# EasyEDA Pro project ProPrj_New Project_2026-03-26_23-50-09_2026-04-04.epro

# Schematic Schematic1
Board Name: Board1; Create Date: 2026-03-26; Page Name: P1; Project Name: New Project_2026-03-26_23-50-09; Schematic Name: Schematic1; Update Date: 2026-03-27; Company: 嘉立创EDA; Page Size: A4; Version: V1.0
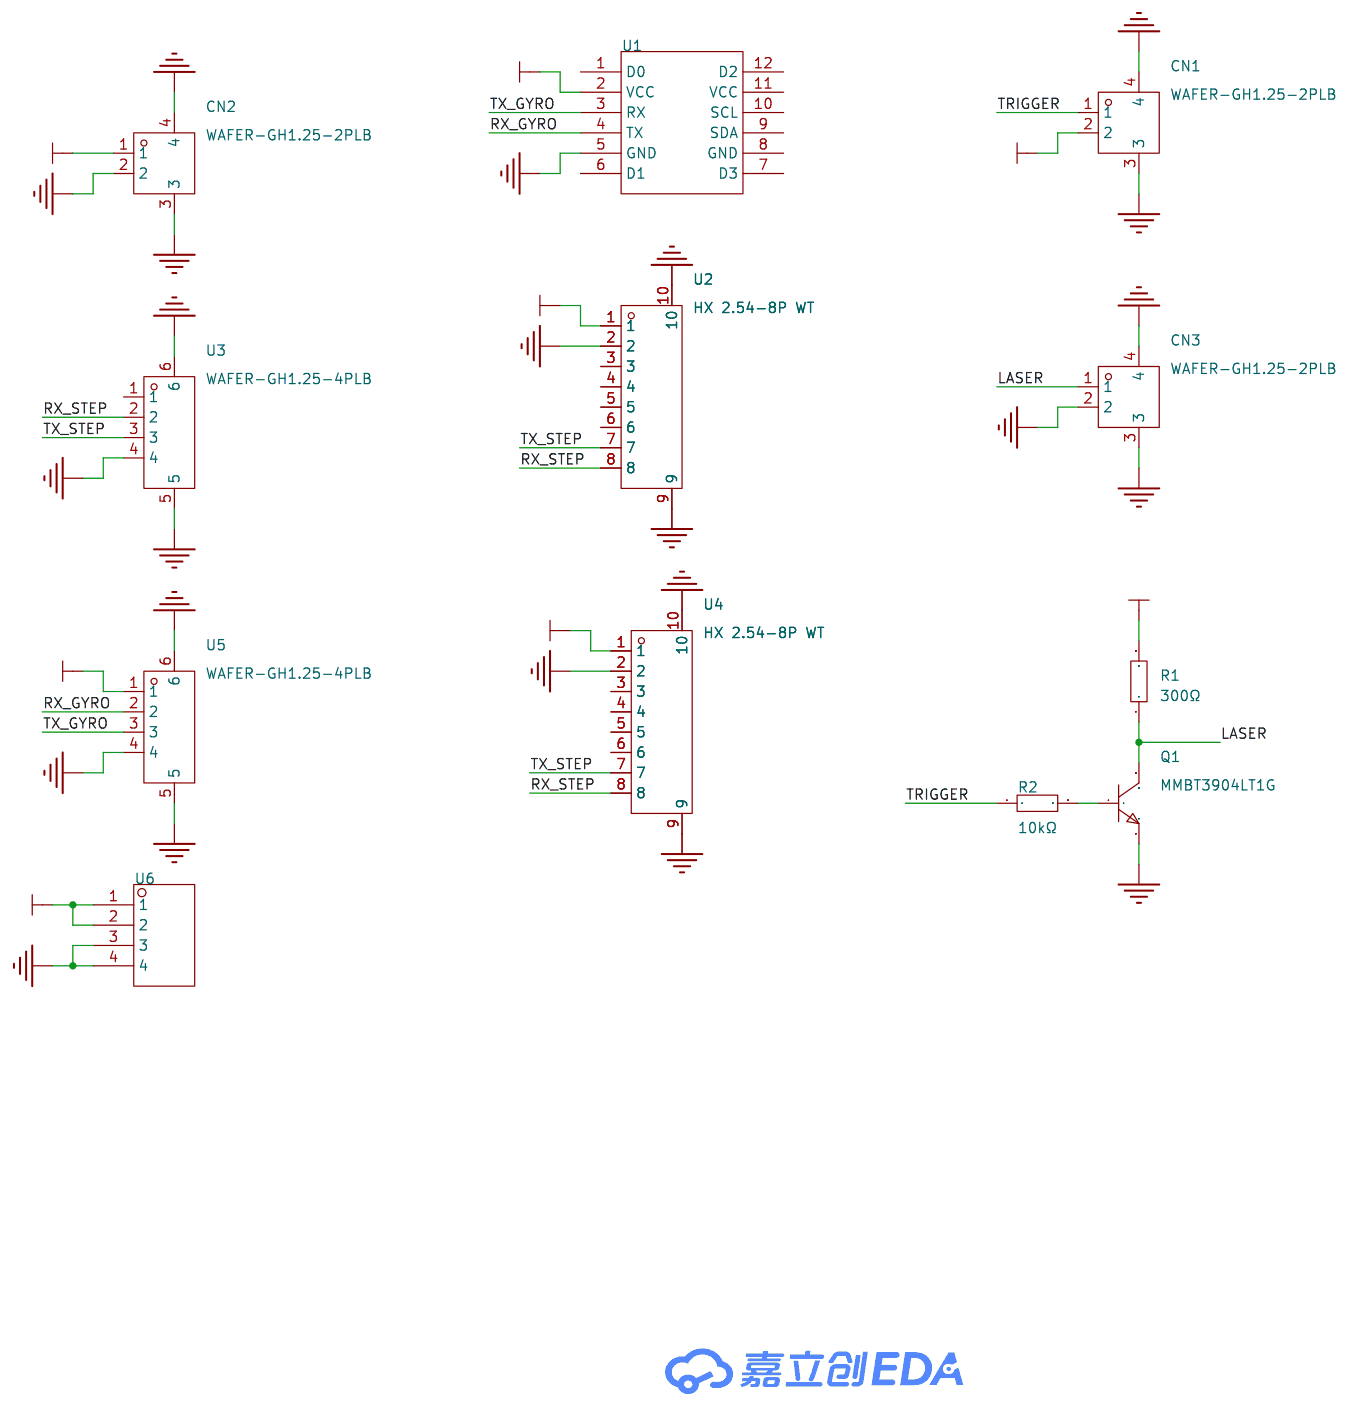
[diagram p0: schematic sheet]

## Parts
CN1  WAFER-GH1.25-2PLB  [CONN-TH_2P-P1.25_XUNPU_WAFER-GH1.25-2PLB]
CN2  WAFER-GH1.25-2PLB  [CONN-TH_2P-P1.25_XUNPU_WAFER-GH1.25-2PLB]
CN3  WAFER-GH1.25-2PLB  [CONN-TH_2P-P1.25_XUNPU_WAFER-GH1.25-2PLB]
Q1  MMBT3904LT1G  [SOT-23-3_L2.9-W1.6-P1.90-LS2.8-BR]
R1  300Ω  [R0603]
R2  10kΩ  [R0603]
U1  -  [JY61P]
U2  HX 2.54-8P WT  [CONN-SMD_8P-P2.50_HANXIA_HX-2.54-8P-WTDK]
U3  WAFER-GH1.25-4PLB  [CONN-SMD_4P-P1.25_XUNPU_WAFER-GH1.25-4PLB]
U4  HX 2.54-8P WT  [CONN-SMD_8P-P2.50_HANXIA_HX-2.54-8P-WTDK]
U5  WAFER-GH1.25-4PLB  [CONN-SMD_4P-P1.25_XUNPU_WAFER-GH1.25-4PLB]
U6  -  [Slip Ring]

## Library data of the parts
CN1-CN3 = WAFER-GH1.25-2PLB: 插针结构:1x2P;间距:1.25mm;安装方式:立贴;参考系列:GH;总PIN数:2P;排数:1;每排PIN数:2;行距:-;额定电流:1A;触头材质:黄铜;触头镀层:锡;工作温度:-25℃~+85℃;; LCSC Part Name: 1x2P 间距:1.25mm 立贴 系列:GH; Supplier Part: C3029368; Manufacturer: XUNPU(讯普); Supplier Footprint: SMD,P=1.25mm; JLCPCB Part Class: 扩展库; Datasheet: https://item.szlcsc.com/datasheet/WAFER-GH1.25-2PLB/3561380.html; Supplier: LCSC; Pins Structure: 1x2P; Pitch: 1.25mm; Mounting Type: 立贴; Reference Series: GH; Number of Pins: 2P; Number of Rows: 1; Number of PINs Per Row: 2; Current Rating: 1A; Contact Material: 黄铜; Contact Plating: 锡; Operating Temperature: -25℃~+85℃; Voltage Rating: 125V; Plastic Material: LCP; Supplementary Features: 辅助焊脚; Color: 米色; Z-Height of the Board: 4.2mm; X-Length of Bottom Edge on Board (Spacing Line): 5.75mm; Y-Width of Bottom Edge on Board: 4.95mm
Q1 = MMBT3904LT1G: 晶体管类型:NPN;集电极电流(Ic):200mA;集射极击穿电压(Vceo):40V;耗散功率(Pd):225mW;直流电流增益(hFE):40@0.1mA,1.0V;; LCSC Part Name: NPN 电流:200mA 电压:40V; Supplier Part: C81464; Manufacturer: onsemi(安森美); Supplier Footprint: SOT-23; JLCPCB Part Class: 扩展库; Datasheet: https://item.szlcsc.com/datasheet/MMBT3904LT1G/82615.html; Supplier: LCSC; type: NPN; Current - Collector(Ic): 200mA; Collector - Emitter Voltage VCEO: 40V; Pd - Power Dissipation: 225mW; DC Current Gain: 40@0.1mA,1.0V; Transition frequency(fT): 300MHz; Current - Collector Cutoff: 50nA; Vce Saturation(VCE(sat)): 200mV; Operating Temperature: -55℃~+150℃
R1 = 0603WAF3000T5E: 电阻类型:厚膜电阻;阻值:300Ω;精度:±1%;功率:100mW;工作电压:75V;温度系数:±100ppm/℃;; LCSC Part Name: 300Ω ±1% 100mW 厚膜电阻; Supplier Part: C23025; Manufacturer: UNI-ROYAL(厚声); Supplier Footprint: 0603; JLCPCB Part Class: 基础库; Datasheet: https://item.szlcsc.com/datasheet/0603WAF3000T5E/23752.html; Supplier: LCSC; Type: 厚膜电阻; Tolerance: ±1%; Power(Watts): 100mW; Voltage-Supply(Max): 75V; Temperature Coefficient: ±100ppm/℃; Operating Temperature: -55℃~+155℃
R2 = RC0603FR-0710KL: 电阻类型:厚膜电阻;阻值:10kΩ;精度:±1%;功率:100mW;最大工作电压:75V;温度系数:±100ppm/℃;; LCSC Part Name: 厚膜电阻 10kΩ ±1% 100mW; Supplier Part: C98220; Manufacturer: YAGEO(国巨); Supplier Footprint: 0603; JLCPCB Part Class: 扩展库; Datasheet: https://atta.szlcsc.com/upload/public/pdf/source/20180927/C295883_E8D83085EA81BD7DE0B2B681138C15EE.pdf; Supplier: LCSC; Type: 厚膜电阻; Tolerance: ±1%; Power(Watts): 100mW; Overload Voltage (Max): 75V; Temperature Coefficient: ±100ppm/℃; Operating Temperature Range: -55℃~+155℃
U1 = JY61P
U2 U4 = HX 2.54-8P WT: 插针结构:1x8P;间距:2.54mm;安装方式:卧贴;参考系列:XH;总PIN数:8P;排数:1;每排PIN数:8;额定电流:3A;工作温度范围:-25℃~+85℃;; LCSC Part Name: 1x8P 间距:2.54mm 卧贴; Supplier Part: C5343093; Manufacturer: hanxia(韩下); Supplier Footprint: SMD,P=2.54mm,卧贴; JLCPCB Part Class: 扩展库; Datasheet: https://atta.szlcsc.com/upload/public/pdf/source/20230104/FDDBA8FE336155D98DF4DE4FDBBBCFC0.pdf; Supplier: LCSC; Pins Structure: 1x8P; Pitch: 2.54mm; Mounting Style: 卧贴; Reference Series: XH; Number of Pins: 8P; Number of Rows: 1; Number of PINs Per Row: 8; Current Rating (Max): 3A; Operating Temperature Range: -25℃~+85℃
U3 U5 = WAFER-GH1.25-4PLB: 插针结构:1x4P;间距:1.25mm;安装方式:立贴;参考系列:GH;总PIN数:4P;排数:1;每排PIN数:4;行距:-;额定电流:1A;触头材质:黄铜;触头镀层:锡;工作温度:-25℃~+85℃;; LCSC Part Name: 1x4P 间距:1.25mm 立贴 系列:GH; Supplier Part: C3029370; Manufacturer: XUNPU(讯普); Supplier Footprint: SMD,P=1.25mm; JLCPCB Part Class: 扩展库; Datasheet: https://item.szlcsc.com/datasheet/WAFER-GH1.25-4PLB/3561382.html; Supplier: LCSC; Pins Structure: 1x4P; Pitch: 1.25mm; Mounting Type: 立贴; Reference Series: GH; Number of Pins: 4P; Number of Rows: 1; Number of PINs Per Row: 4; Current Rating: 1A; Contact Material: 黄铜; Contact Plating: 锡; Operating Temperature: -25℃~+85℃; Voltage Rating: 125V; Plastic Material: LCP; Supplementary Features: 辅助焊脚; Color: 米色; Z-Height of the Board: 4.2mm; X-Length of Bottom Edge on Board (Spacing Line): 8.25mm; Y-Width of Bottom Edge on Board: 4.95mm
U6 = Slip Ring

## Nets
+5V: U1.2(VCC) U5.1
+12V: CN2.1 U2.1 U4.1 U6.1 U6.2
GND: CN1.3 CN1.4 CN2.2 CN2.3 CN2.4 CN3.2 CN3.3 CN3.4 Q1.2 U1.5(GND) U2.2 U2.9 U2.10 U3.4 U3.5 U3.6 U4.2 U4.9 U4.10 U5.4 U5.5 U5.6 U6.3 U6.4
LASER: CN3.1 Q1.3 R1.1
LPWR: CN1.2 R1.2
RX_GYRO: U1.4(TX) U5.2
RX_STEP: U2.8 U3.2 U4.8
TRIGGER: CN1.1 R2.1
TX_GYRO: U1.3(RX) U5.3
TX_STEP: U2.7 U3.3 U4.7
$1N2401: Q1.1 R2.2

Not connected (* = marked no-connect by the designer): U1 1(D0) 6(D1) 7(D3) 8(GND) 9(SDA) 10(SCL) 11(VCC) 12(D2); U2 3 4 5 6; U3 1; U4 3 4 5 6

# Board PCB1
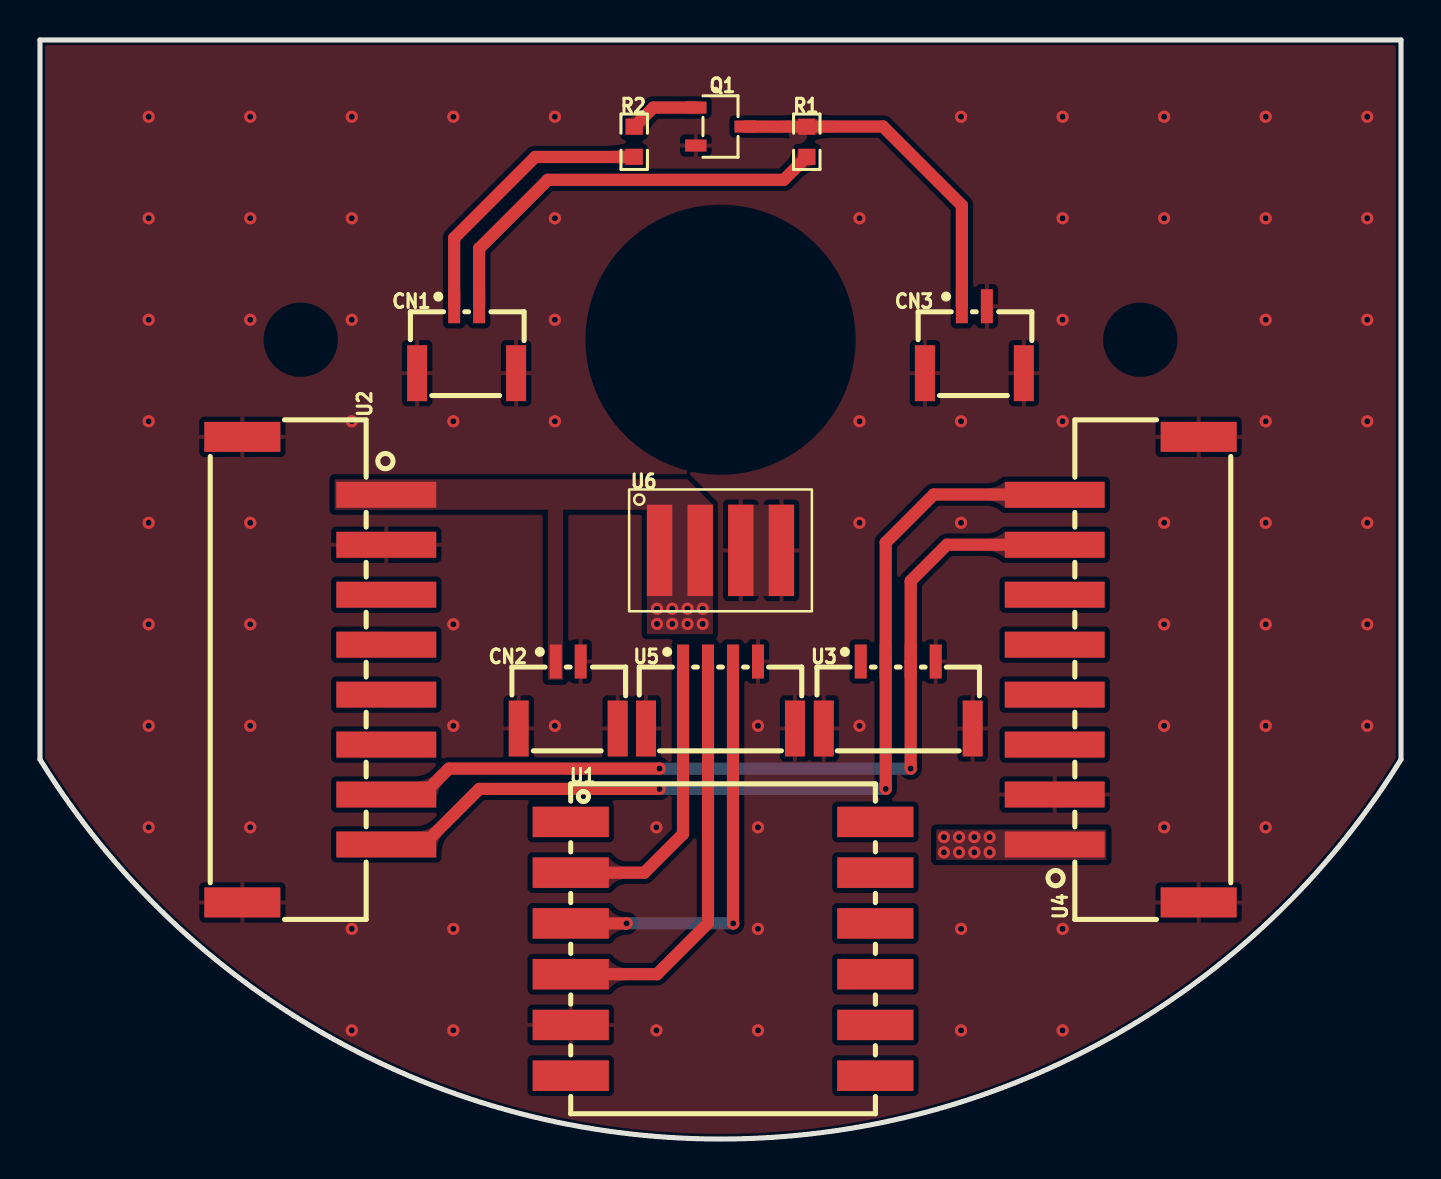
[diagram p1: board, top side]
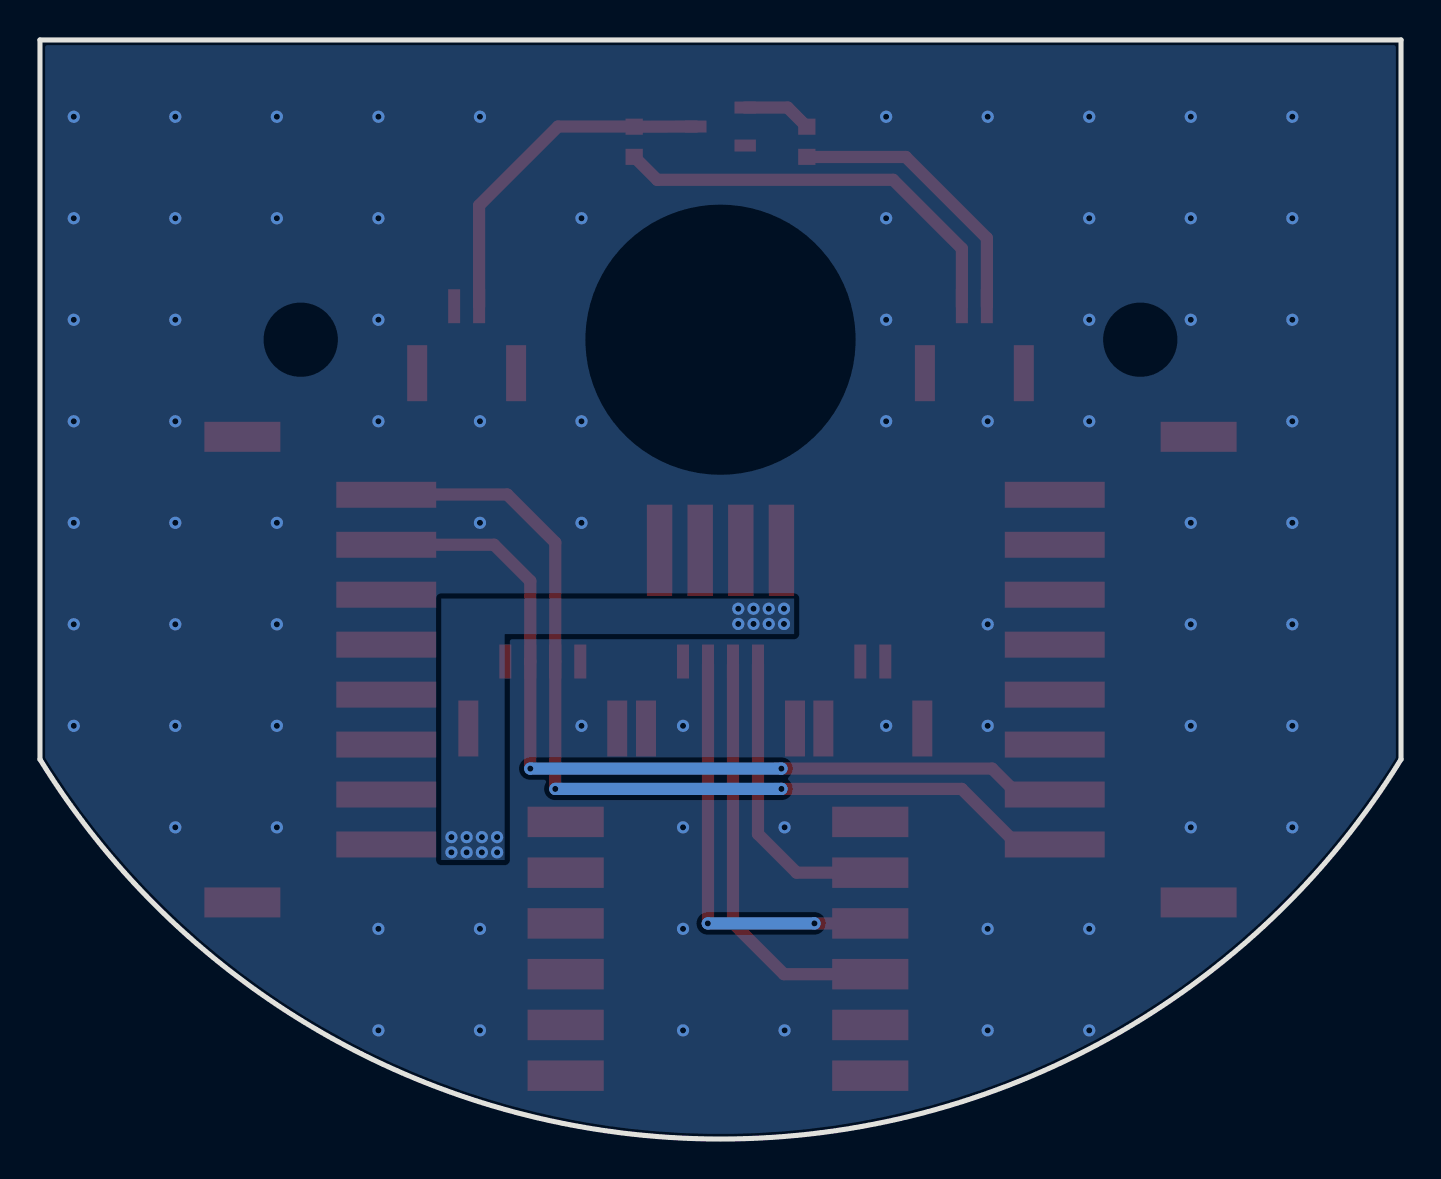
[diagram p2: board, bottom side, seen from below]

Outline 68.09 x 55 mm; copper layers: Top Layer, Bottom Layer. Coordinates in mm from the lower left corner of the outline.
Outline path: 0,55 68.09,55 68.09,19 arc(34.04,0) 0,19 0,55
Stack: Top Layer 0.035mm / Dielectric1 1.51mm FR4 er 4.5 / Bottom Layer 0.035mm

## Design rules (mm)
template: JLCPCB Capability(Two Layers Board)
spacing copperThickness1oz (default): track to track 0.102, other pairs 0.152 to 0.3
spacing copperThickness2oz: track to track 0.203, other pairs 0.152 to 0.3
track width copperThickness1oz (default): min 0.127, default 0.254, max 2.54
track width copperThickness2oz: min 0.203, default 0.254, max 2.54
differential pair differentialPair (default): width min 0.127, default 0.254, max 2.54; gap min 0.152, default 0.152
via viaSize (default): diameter min 0.5, default 0.61, max 10; hole min 0.3, default 0.305, max 6.3

## Placement (name value [footprint] x y rotation side)
CN1  WAFER-GH1.25-2PLB  [CONN-TH_2P-P1.25_XUNPU_WAFER-GH1.25-2PLB]  21.34 40 0 top
CN2  WAFER-GH1.25-2PLB  [CONN-TH_2P-P1.25_XUNPU_WAFER-GH1.25-2PLB]  26.42 22.22 0 top
CN3  WAFER-GH1.25-2PLB  [CONN-TH_2P-P1.25_XUNPU_WAFER-GH1.25-2PLB]  46.74 40 0 top
Q1  MMBT3904LT1G  [SOT-23-3_L2.9-W1.6-P1.90-LS2.8-BR]  34.04 50.67 180 top
R1  300Ω  [R0603]  38.36 49.91 270 top
R2  10kΩ  [R0603]  29.73 49.91 90 top
U1  -  [JY61P]  26.55 15.87 0 top
U2  HX 2.54-8P WT  [CONN-SMD_8P-P2.50_HANXIA_HX-2.54-8P-WTDK]  13.72 23.49 270 top
U3  WAFER-GH1.25-4PLB  [CONN-SMD_4P-P1.25_XUNPU_WAFER-GH1.25-4PLB]  42.93 22.22 0 top
U4  HX 2.54-8P WT  [CONN-SMD_8P-P2.50_HANXIA_HX-2.54-8P-WTDK]  54.36 23.49 90 top
U5  WAFER-GH1.25-4PLB  [CONN-SMD_4P-P1.25_XUNPU_WAFER-GH1.25-4PLB]  34.04 22.22 0 top
U6  -  [Slip Ring]  34.04 29.33 0 top

## Footprints (pads in the part's own frame, mm; a bottom-side part is the same pattern mirrored in y, then rotated)
CONN-SMD_4P-P1.25_XUNPU_WAFER-GH1.25-4PLB
  rect 0.6x1.7 smd: 1(-1.875,1.675) 2(-0.625,1.675) 3(0.625,1.675) 4(1.875,1.675)
  rect 1x2.8 smd: 5(-3.725,-1.675) 6(3.725,-1.675)
CONN-SMD_8P-P2.50_HANXIA_HX-2.54-8P-WTDK
  rect 1.3x5 smd: 1(-8.75,3.6) 2(-6.25,3.6) 3(-3.75,3.6) 4(-1.25,3.6) 5(1.25,3.6) 6(3.75,3.6) 7(6.25,3.6) 8(8.75,3.6)
  rect 1.5x3.8 smd: 9(11.65,-3.6) 10(-11.65,-3.6)
CONN-TH_2P-P1.25_XUNPU_WAFER-GH1.25-2PLB
  rect 0.6x1.7 smd: 1(-0.625,1.675) 2(0.625,1.675)
  rect 1x2.8 smd: 3(2.475,-1.675) 4(-2.475,-1.675)
JY61P
  rect 3.81x1.524 smd: 1(0,0) 2(0,-2.54) 3(0,-5.08) 4(0,-7.62) 5(0,-10.16) 6(0,-12.7) 7(15.24,-12.7) 8(15.24,-10.16) 9(15.24,-7.62) 10(15.24,-5.08) 11(15.24,-2.54) 12(15.24,0)
R0603
  rect 0.806x0.864 smd: 1(-0.753,0) 2(0.753,0)
Slip Ring
  rect 1.27x4.572 smd: 1(-3.048,0.127) 2(-1.016,0.127) 3(1.016,0.127) 4(3.048,0.127)
SOT-23-3_L2.9-W1.6-P1.90-LS2.8-BR
  rect 1.07x0.6 smd: 1(1.235,-0.95) 2(1.235,0.95) 3(-1.235,0)

## Nets
As in the schematic.

Pads without a net: U1 1 6 7 8 9 10 11 12; U2 3 4 5 6; U3 1; U4 3 4 5 6

## Via types
v1: diameter 0.61, hole 0.305, Top Layer to Bottom Layer, 96 vias

## Routing (per net, layer and track width the routed paths; a pad name or vN(x,y) marks a point on that pad's centre or on a via; arc(x,y) is an arc through that point)
+5V: length 15
  Top Layer w0.61: 32.17,23.74 32.17,15.26 30.23,13.33 26.42,13.33
+12V:
  vias: v1(30.87,26.54) v1(30.87,25.78) v1(31.63,26.54) v1(31.63,25.78) v1(32.39,26.54) v1(32.39,25.78) v1(33.15,26.54) v1(33.15,25.78) v1(45.22,15.11) v1(45.22,14.35) v1(45.98,15.11) v1(45.98,14.35) v1(46.74,15.11) v1(46.74,14.35) v1(47.51,15.11) v1(47.51,14.35)
GND:
  vias: v1(5.44,51.16) v1(5.44,46.08) v1(5.44,41) v1(5.44,35.92) v1(5.44,30.84) v1(5.44,25.76) v1(5.44,20.68) v1(5.44,15.6) v1(10.52,51.16) v1(10.52,46.08) v1(10.52,41) v1(10.52,30.84) v1(10.52,25.76) v1(10.52,20.68) v1(10.52,15.6) v1(15.6,51.16) v1(15.6,46.08) v1(15.6,41) v1(15.6,35.92) v1(15.6,10.52) v1(15.6,5.44) v1(20.68,51.16) v1(20.68,35.92) v1(20.68,25.76) v1(20.68,20.68) v1(20.68,10.52) v1(20.68,5.44) v1(25.76,51.16) v1(25.76,46.08) v1(25.76,41) v1(25.76,35.92) v1(25.76,20.68) v1(30.84,15.6) v1(30.84,5.44) v1(35.92,20.68) v1(35.92,15.6) v1(35.92,10.52) v1(35.92,5.44) v1(41,46.08) v1(41,35.92) v1(41,30.84) v1(41,20.68) v1(46.08,51.16) v1(46.08,35.92) v1(46.08,30.84) v1(46.08,10.52) v1(46.08,5.44) v1(51.16,51.16) v1(51.16,46.08) v1(51.16,41) v1(51.16,35.92) v1(51.16,10.52) v1(51.16,5.44) v1(56.24,51.16) v1(56.24,46.08) v1(56.24,30.84) v1(56.24,25.76) v1(56.24,20.68) v1(56.24,15.6) v1(61.32,51.16) v1(61.32,46.08) v1(61.32,41) v1(61.32,35.92) v1(61.32,30.84) v1(61.32,25.76) v1(61.32,20.68) v1(61.32,15.6) v1(66.4,51.16) v1(66.4,46.08) v1(66.4,41) v1(66.4,35.92) v1(66.4,30.84) v1(66.4,25.76) v1(66.4,20.68)
LASER: length 17.5
  Top Layer w0.61: Q1.3 R1.1 38.37,50.67 42.17,50.67 46.12,46.72 CN3.1
LPWR: length 21.2
  Top Layer w0.61: R1.2 37.21,48 25.41,48 21.97,44.56 CN1.2
RX_GYRO: length 21
  Top Layer w0.61: 33.42,23.74 33.42,10.8 30.87,8.25 26.42,8.25
RX_STEP: length 47.9
  Top Layer w0.61: v1(42.31,17.52) U3.2 42.31,29.85 44.71,32.25 50.75,32.25 U4.8 ; U2.8 19.2,14.74 21.98,17.52 v1(31,17.52)
  Bottom Layer w0.61: v1(31,17.52) 42.3,17.52
TRIGGER: length 14.1
  Top Layer w0.61: CN1.1 20.72,45.09 24.77,49.14 29.72,49.14 R2.1
TX_GYRO: length 21.2
  Top Layer w0.61: v1(34.68,10.79) 34.67,10.8 34.67,23.74 ; v1(29.34,10.79) 26.42,10.79
  Bottom Layer w0.61: v1(34.68,10.79) v1(29.34,10.79)
TX_STEP: length 44.1
  Top Layer w0.61: U2.7 19.16,17.24 20.45,18.54 v1(31,18.54) ; v1(43.56,18.54) U3.3 43.56,27.92 45.37,29.74 U4.7
  Bottom Layer w0.61: v1(43.56,18.54) v1(31,18.54)
$1N2401: length 3.5
  Top Layer w0.61: Q1.1 30.68,51.62 R2.2

## Copper pours and planes (outline as drawn; the poured copper is in the pictures)
+12V on Top Layer: 14.74,33.01 33.66,33.01 33.66,22.98 14.74,22.98
+12V on Top Layer: 44.84,15.49 53.35,15.49 53.35,13.96 44.84,13.96
+12V on Bottom Layer: 30.36,27.05 48.01,27.05 48.01,13.96 30.36,13.96
GND on Top Layer: 34.42,31.74 37.73,31.74 37.73,27.17 34.42,27.17
GND on Top Layer: 0,55 68.08,55 68.08,-0.13 0,-0.13
GND on Bottom Layer: 0,55 68.08,55 68.08,-0.13 0,-0.13

Small or netless copper shapes (teardrops, artwork), in the pictures only: 18 on Top Layer, 6 on Bottom Layer
